# EAGLE design amp (EAGLE 8.2.2)
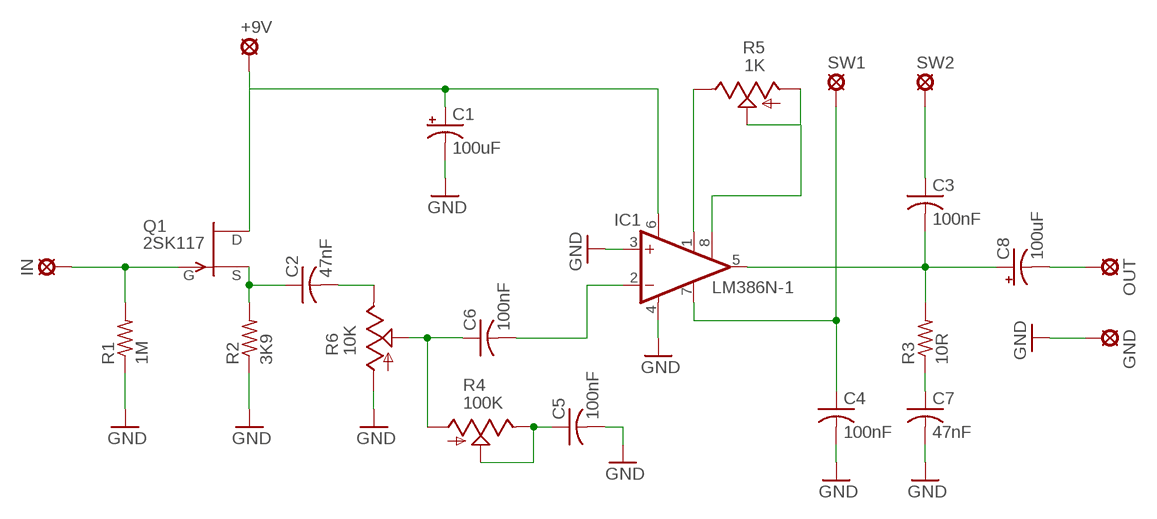
[diagram p0: schematic, sheet 1]

## Parts
+9V  MCS10B  [MCS10B]
C1  100uF  CPOL-USTT2D5  [TT2D5]
C2  47nF  C-US050-025X075  [C050-025X075]
C3  100nF  C-US050-025X075  [C050-025X075]
C4  100nF  C-US050-025X075  [C050-025X075]
C5  100nF  C-US050-025X075  [C050-025X075]
C6  100nF  C-US050-025X075  [C050-025X075]
C7  47nF  C-US050-025X075  [C050-025X075]
C8  100uF  CPOL-USTT2D5  [TT2D5]
GND  MCS10B  [MCS10B]
IC1  LM386N-1  [DIL08]
IN  MCS10B  [MCS10B]
OUT  MCS10B  [MCS10B]
Q1  2SK117  [TO-92]
R1  1M  R-US_0207/7  [0207/7]
R2  3K9  R-US_0207/7  [0207/7]
R3  10R  R-US_0207/7  [0207/7]
R4  100K  TRIM_US-B64Y  [B64Y]
R5  1K  TRIM_US-B64Y  [B64Y]
R6  10K  TRIM_US-B64Y  [B64Y]
SW1  MCS10B  [MCS10B]
SW2  MCS10B  [MCS10B]

## Nets
GND: C1.- C4.2 C5.2 C7.2 GND.MP IC1.3(+IN) IC1.4(GND) R1.1 R2.1 R6.A
N$1: IN.MP Q1.2(G) R1.2
N$2: C2.1 Q1.3(S) R2.2
N$3: C2.2 R6.E
N$4: C6.1 R4.A R6.S
N$5: C5.1 R4.E R4.S
N$6: C6.2 IC1.2(-IN)
N$7: +9V.MP C1.+ IC1.6(VS) Q1.1(D)
N$8: IC1.1(GAIN) R5.E
N$11: IC1.8(GAIN) R5.A R5.S
N$12: C3.1 SW2.MP
N$13: C4.1 IC1.7(BYPASS) SW1.MP
N$14: C7.1 R3.1
N$15: C3.2 C8.+ IC1.5(OUT) R3.2
N$16: C8.- OUT.MP

## Library data of the parts
+9V GND IN OUT SW1 SW2 = solpad:MCS10B: SOLDER PAD MC S1, distributor Buerklin, 15F505
C1 C8 = rcl:CPOL-US: POLARIZED CAPACITOR, American symbol
C2-C7 = rcl:C-US: CAPACITOR, American symbol
IC1 = linear:LM386?-*: Low Voltage Audio Power Amplifier Source: http://cache.national.com/ds/LM/LM386.pdf
Q1 = toshiba-jfet:2SK117
R1-R3 = rcl:R-US_: RESISTOR, American symbol
R4-R6 = pot:TRIM_US-: POTENTIOMETER

## Board
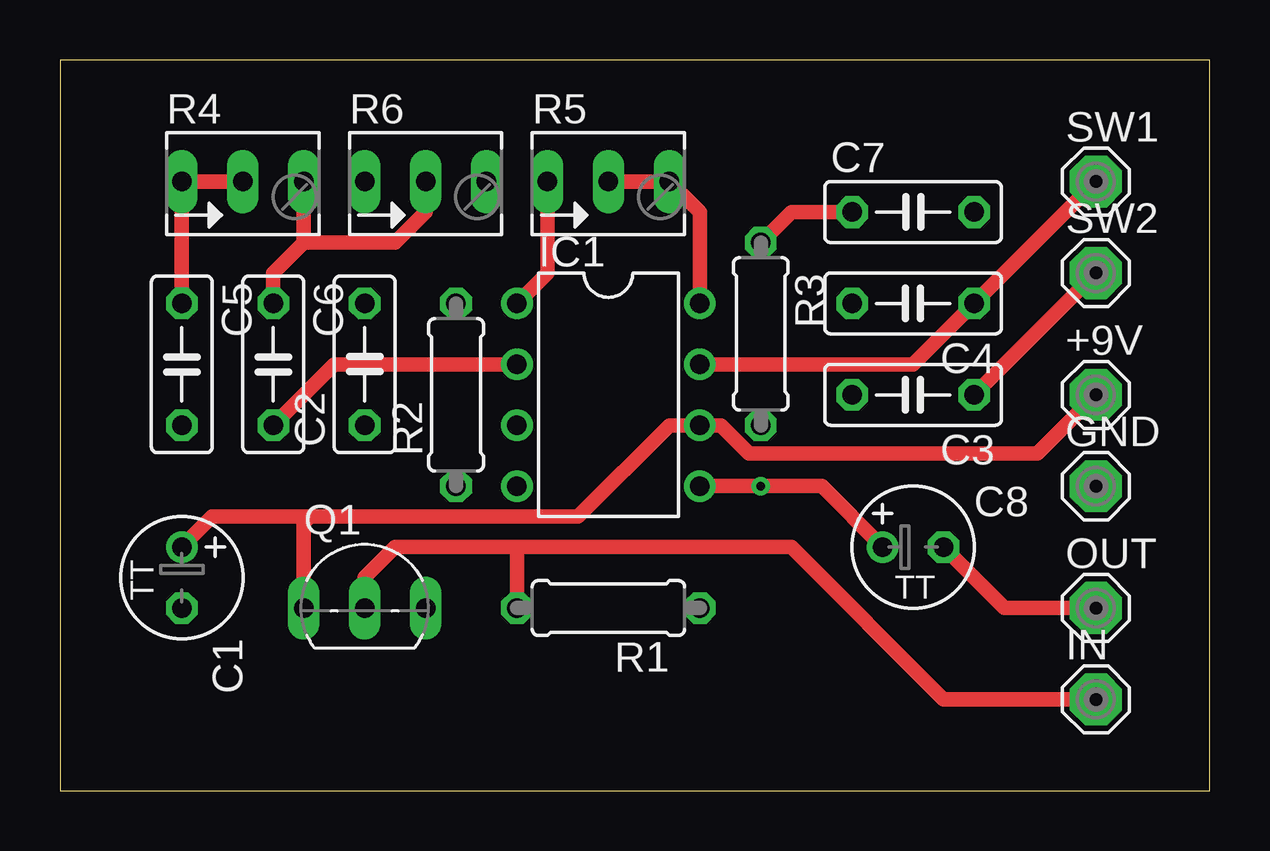
[diagram p1: board, top side]
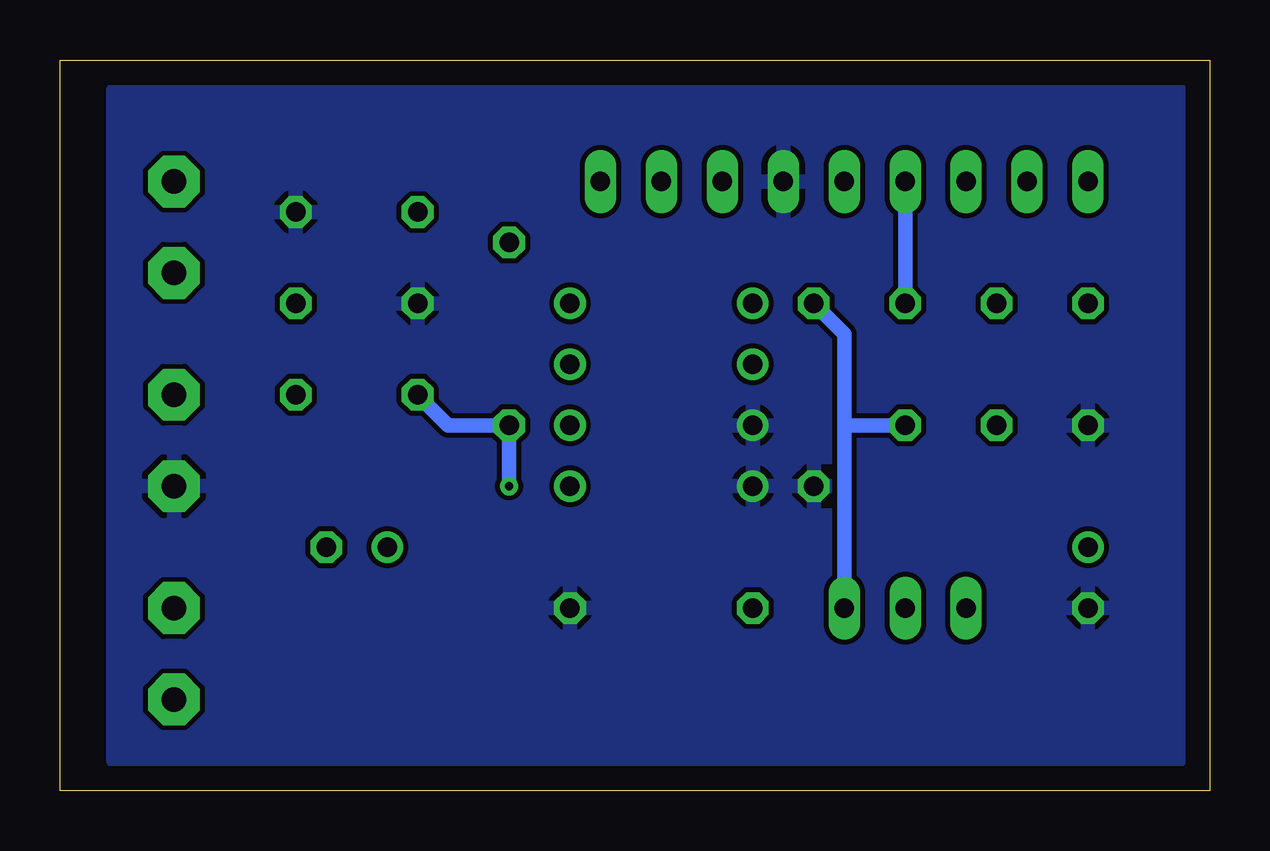
[diagram p2: board, bottom side, seen from below]

Size 47.93 x 30.47 mm. Coordinates in mm from the lower left corner, seen from the top.
Outline: 0,0 47.93,0 47.93,30.47 0,30.47 0,0
Copper layers (1*16): Top 0.035mm / dielectric 1.5mm / Bottom 0.035mm
Design rules "default": minimum track width 10mil, minimum drill 24mil, track to track 8mil, track to pad 8mil, pad to pad 8mil, via to via 8mil, smd to smd 8mil, copper to edge 40mil, drill to drill 8mil, minimum pad ring 10mil, minimum via ring 8mil, stop-mask expansion 4mil, vias tented up to drill 0mil, thermal gap 10mil

### Footprints (pad centres in the part's own frame; a part is rotated, then mirrored left to right if it is on the bottom)
MCS10B = drill 1.016 pad 2.159 octagon: MP 0,0
TT2D5 = drill 0.813: + -1.27,0 | drill 0.813 octagon: - 1.27,0
C050-025X075 = drill 0.813 octagon: 1 -2.54,0; 2 2.54,0
DIL08 = drill 0.813 pad 1.27: 1 -3.81,-3.81; 2 -1.27,-3.81; 3 1.27,-3.81; 4 3.81,-3.81; 5 3.81,3.81; 6 1.27,3.81; 7 -1.27,3.81; 8 -3.81,3.81
TO-92 = drill 0.813 long: 1 -2.54,0; 2 0,0; 3 2.54,0
0207/7 = drill 0.813 octagon: 1 -3.81,0; 2 3.81,0
B64Y = drill 0.813 long: A 2.54,0; E -2.54,0; S 0,0

### Placement (x,y rotation side)
+9V  43.18,16.51 0 top
C1  5.08,8.89 270 top
C2  12.7,17.78 90 top
C3  35.56,16.51 180 top
C4  35.56,20.32 180 top
C5  5.08,17.78 270 top
C6  8.89,17.78 270 top
C7  35.56,24.13 0 top
C8  35.56,10.16 0 top
GND  43.18,12.7 0 top
IC1  22.86,16.51 270 top
IN  43.18,3.81 0 top
OUT  43.18,7.62 0 top
Q1  12.7,7.62 0 top
R1  22.86,7.62 180 top
R2  16.51,16.51 90 top
R3  29.21,19.05 270 top
R4  7.62,25.4 0 top
R5  22.86,25.4 0 top
R6  15.24,25.4 0 top
SW1  43.18,25.4 0 top
SW2  43.18,21.59 0 top

### Tracks (layer width: path | path; a pad name or v marks a point on that pad's centre or on a via)
GND
  pour Bottom: 1.27,29.21 45.72,29.21 45.72,1.27 1.27,1.27
N$1
  Top 0.61: IN.MP 36.83,3.81 30.48,10.16 19.12,10.16 19.05,10.09 | Q1.2 12.7,8.89 13.97,10.16 18.98,10.16 19.05,10.09 | 19.05,10.09 R1.2
N$2
  Bottom 0.61: R2.2 15.24,19.05 15.24,15.19 | 15.24,15.19 Q1.3 | C2.1 15.19,15.24 15.24,15.19
N$3
  Bottom 0.61: C2.2 R6.E
N$4
  Top 0.61: C6.1 8.89,21.59 10.16,22.86 | 10.16,22.86 13.97,22.86 15.24,24.13 R6.S | 10.16,22.86 R4.A
N$5
  Top 0.61: C5.1 R4.E R4.S
N$6
  Top 0.61: C6.2 11.43,17.78 IC1.2
N$7
  Top 0.61: +9V.MP 40.74,14.07 28.73,14.07 27.56,15.24 IC1.6 25.4,15.24 21.59,11.43 10.43,11.43 | 10.43,11.43 6.35,11.43 C1.+ | Q1.1 10.16,11.16 10.43,11.43
N$8
  Top 0.61: IC1.1 20.32,21.59 R5.E
N$11
  Top 0.61: R5.S R5.A 26.67,24.13 IC1.8
N$12
  Top 0.61: C3.1 SW2.MP
N$13
  Top 0.61: SW1.MP C4.1 35.56,17.78 IC1.7
N$14
  Top 0.61: R3.1 30.48,24.13 C7.1
N$15  (via drill 0.35)
  Top 0.61: IC1.5 v29.21,12.7 31.75,12.7 C8.+
  Bottom 0.61: C3.2 31.75,15.24 R3.2 v29.21,12.7
N$16
  Top 0.61: C8.- 39.37,7.62 OUT.MP